# EAGLE design tube-core_sch-pcb (EAGLE 9.5.1)
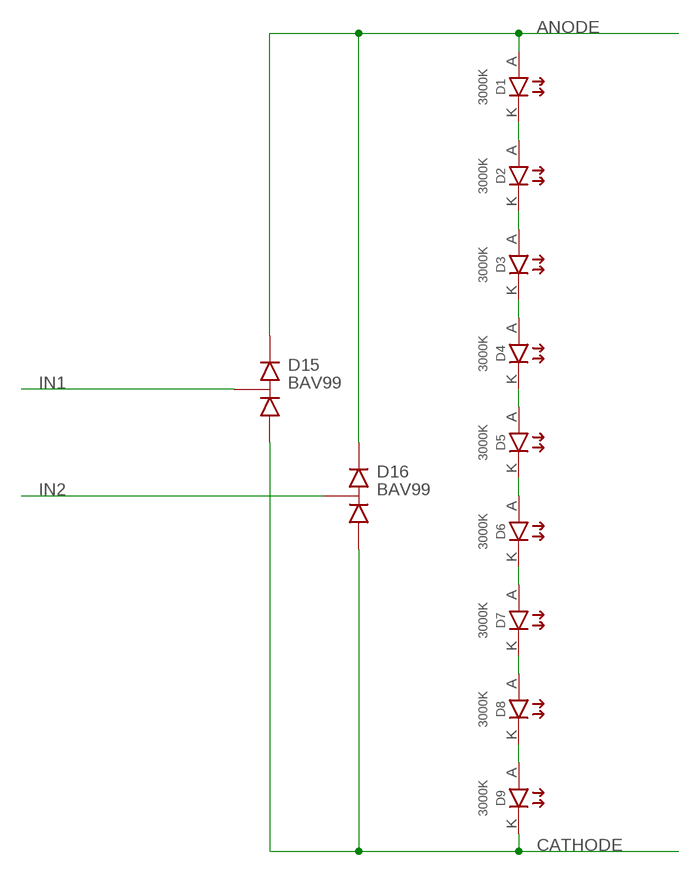
[diagram p0: schematic, sheet 1]

## Parts
D1  3000K  MP-1616-1100-30-90  [MP-1616]
D2  3000K  MP-1616-1100-30-90  [MP-1616]
D3  3000K  MP-1616-1100-30-90  [MP-1616]
D4  3000K  MP-1616-1100-30-90  [MP-1616]
D5  3000K  MP-1616-1100-30-90  [MP-1616]
D6  3000K  MP-1616-1100-30-90  [MP-1616]
D7  3000K  MP-1616-1100-30-90  [MP-1616]
D8  3000K  MP-1616-1100-30-90  [MP-1616]
D9  3000K  MP-1616-1100-30-90  [MP-1616]
D15  BAV99  [SOT23-3]
D16  BAV99  [SOT23-3]

## Nets
ANODE: D1.A D15.3(K) D16.3(K)
CATHODE: D9.K D15.1(A) D16.1(A)
IN1: D15.2(AK)
IN2: D16.2(AK)
N$1: D1.K D2.A
N$2: D2.K D3.A
N$3: D3.K D4.A
N$4: D4.K D5.A
N$5: D5.K D6.A
N$6: D6.K D7.A
N$7: D7.K D8.A
N$8: D8.K D9.A

## Library data of the parts
D1-D9 = OPTO:MP-1616-1100-30-90: LED Lighting Xnova™ Cube White, Warm 3000K 3.3V 150mA 170° 0606 (1616 Metric); DIGIKEY: 1214-1518-1-ND; HEIGHT: 1; PRICE_PER: 0.3
D15 D16 = DIODES:BAV99: Diode Array 1 Pair Series Connection Standard 75V 300mA (DC) Surface Mount TO-236-3, SC-59, SOT-23-3; DIGIKEY: BAV99Q-7-FDICT-ND; HEIGHT: 1.2; PRICE_PER: 0.15

## Board
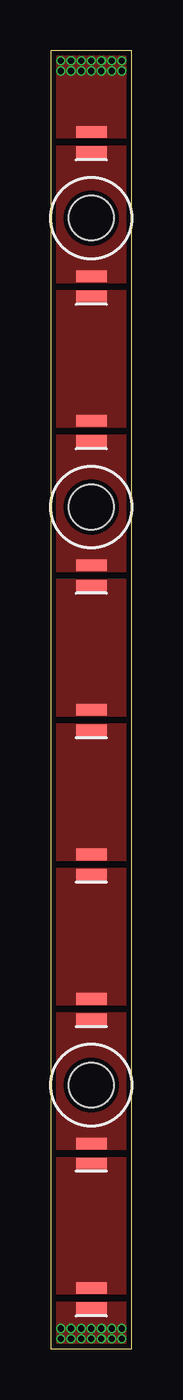
[diagram p1: board, top side]
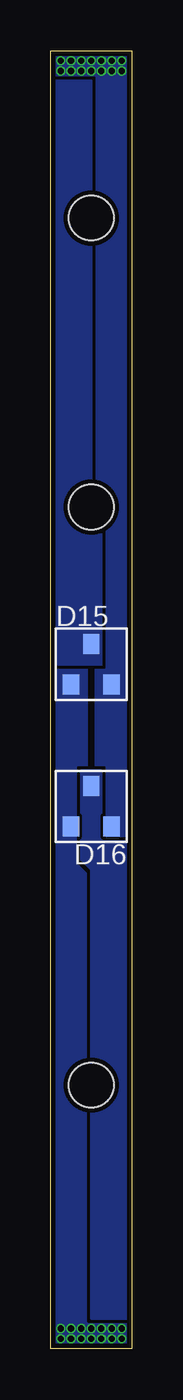
[diagram p2: board, bottom side, seen from below]

Size 4 x 64 mm. Coordinates in mm from the lower left corner, seen from the top.
Outline: 0,64 0,0 4,0 4,64 0,64
Copper layers (1*16): Top 0.035mm / dielectric 0.73mm / Bottom 0.035mm
Design rules "tube-core_drc *": minimum track width 0.15mm, minimum drill 0.25mm, track to track 0.15mm, track to pad 0.15mm, pad to pad 0.15mm, via to via 0.15mm, smd to smd 0mil, copper to edge 0.25mm, drill to drill 0.2mm, minimum pad ring 10mil, minimum via ring 3mil, stop-mask expansion 4mil, vias tented up to drill 1mm, thermal gap 10mil
Holes 2.2 mm at 2,41.5 2,13 2,55.75

### Footprints (pad centres in the part's own frame; a part is rotated, then mirrored left to right if it is on the bottom)
MP-1616 = smd 0.575 x 1.5: A -0.5,0; K 0.5,0
SOT23-3 = smd 0.8 x 1: 1 -1,-1; 2 0,1; 3 1,-1

### Placement (x,y rotation side)
D1  2,59.5 270 top
D2  2,52.38 270 top
D3  2,45.25 270 top
D4  2,38.12 270 top
D5  2,31 270 top
D6  2,23.88 270 top
D7  2,16.75 270 top
D8  2,9.62 270 top
D9  2,2.5 270 top
D15  2,33.75 0 bottom
D16  2,26.75 0 bottom

### Tracks (layer width: path | path; a pad name or v marks a point on that pad's centre or on a via)
ANODE  (via drill 0.3)
  other vias: 2,63.5 2,63 2.5,63 3,63 3.5,63 3.5,63.5 3,63.5 2.5,63.5 1.5,63.5 1,63.5 0.5,63.5 0.5,63 1,63 1.5,63
  pour Bottom (rank 3, no thermals): 4,64 0,64 0,25 1.75,25 1.75,62.75 4,62.75
  pour Top (no thermals): 0,59.75 4,59.75 4,64 0,64
CATHODE  (via drill 0.3)
  other vias: 2,0.5 2,1 2.5,0.5 3,0.5 3.5,0.5 3.5,1 3,1 2.5,1 1.5,1 1,1 0.5,1 0.5,0.5 1,0.5 1.5,0.5
  pour Bottom (rank 3, no thermals): 0,0 4,0 4,33.75 2.25,33.75 2.25,1.25 0,1.25
  pour Top (no thermals): 0,0 4,0 4,2.25 0,2.25
IN1
  pour Bottom (no thermals): 4,33.75 1.5,33.75 1.5,41.25 2,41.75 2,62.5 4,62.5
IN2
  pour Bottom (no thermals): 1.5,28.5 2.5,28.5 2.5,24.12 2,23.62 2,1.5 0,1.5 0,25 1.5,25
N$1
  pour Top (no thermals): 0,52.62 4,52.62 4,59.25 0,59.25
N$2
  pour Top (no thermals): 0,45.5 4,45.5 4,52.12 0,52.12
N$3
  pour Top (no thermals): 0,38.38 4,38.38 4,45 0,45
N$4
  pour Top (no thermals): 0,31.25 4,31.25 4,37.88 0,37.88
N$5
  pour Top (no thermals): 0,24.12 4,24.12 4,30.75 0,30.75
N$6
  pour Top (no thermals): 0,17 4,17 4,23.62 0,23.62
N$7
  pour Top (no thermals): 0,9.88 4,9.88 4,16.5 0,16.5
N$8
  pour Top (no thermals): 0,2.75 4,2.75 4,9.38 0,9.38